# Altium project 驱动.PrjPcb
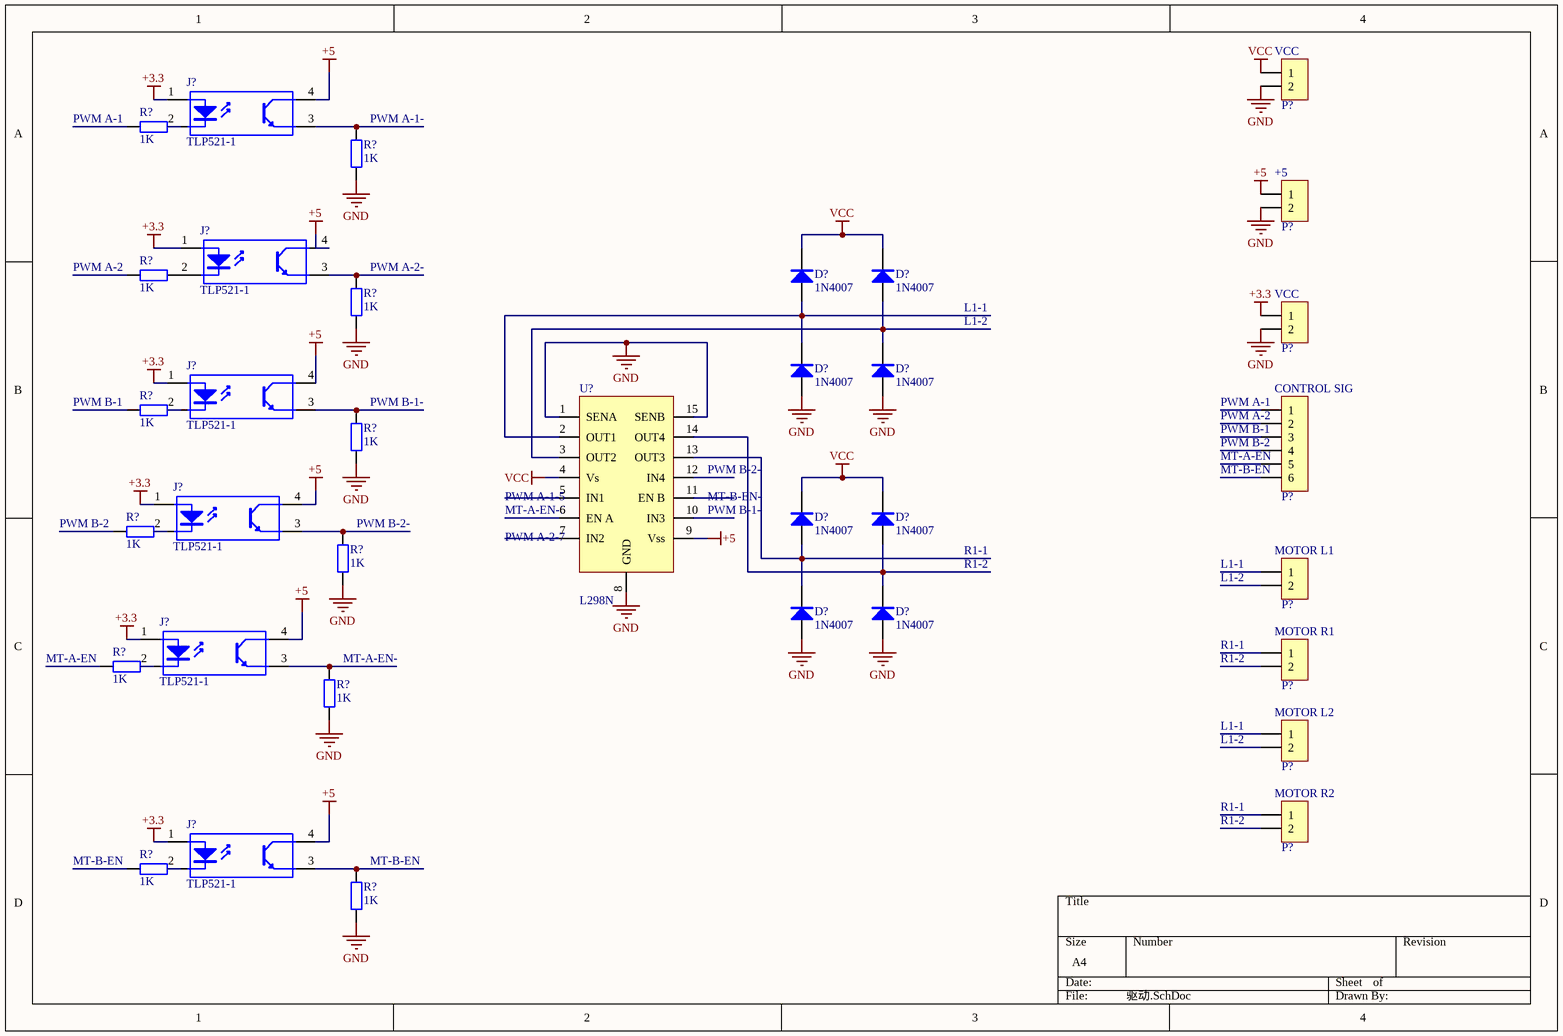
[diagram p0: 驱动.SchDoc]
1 sheet, 35 parts. Net scope: global (net labels, ports and power ports of the same name join across sheets).

## Sheet 驱动.SchDoc
size A4

### Parts
(Parts that share a designator on the sheet are numbered #1, #2 ... from top to bottom, then left to right.)
D?#1  1N4007  [C 1206_M]
D?#2  1N4007  [C 1206_M]
D?#3  1N4007  [C 1206_M]
D?#4  1N4007  [C 1206_M]
D?#5  1N4007  [C 1206_M]
D?#6  1N4007  [C 1206_M]
D?#7  1N4007  [C 1206_M]
D?#8  1N4007  [C 1206_M]
J?#1  TLP521-1  [DIP4-300]
J?#2  TLP521-1  [DIP4-300]
J?#3  TLP521-1  [DIP4-300]
J?#4  TLP521-1  [DIP4-300]
J?#5  TLP521-1  [DIP4-300]
J?#6  TLP521-1  [DIP4-300]
P?#1  HDR-1X2  [MX 1.25-WI-2P]  (value not drawn)
P?#2  HDR-1X2  [MX 1.25-WI-2P]  (value not drawn)
P?#3  HDR-1X2  [MX 1.25-WI-2P]  (value not drawn)
P?#4  CONTROL SIG  [MX 1.25-WI-6P]
P?#5  MOTOR L1  [MX 1.25-WI-2P]
P?#6  MOTOR R1  [MX 1.25-WI-2P]
P?#7  MOTOR L2  [MX 1.25-WI-2P]
P?#8  MOTOR R2  [MX 1.25-WI-2P]
R?#1  1K  [R 0805_L]
R?#2  1K  [R 0805_L]
R?#3  1K  [R 0805_L]
R?#4  1K  [R 0805_L]
R?#5  1K  [R 0805_L]
R?#6  1K  [R 0805_L]
R?#7  1K  [R 0805_L]
R?#8  1K  [R 0805_L]
R?#9  1K  [R 0805_L]
R?#10  1K  [R 0805_L]
R?#11  1K  [R 0805_L]
R?#12  1K  [R 0805_L]
U?  L298N  [Multiwatt15-V]

### Nets
+3.3: J?#1.1(A) J?#2.1(A) J?#3.1(A) J?#4.1(A) J?#5.1(A) J?#6.1(A) P?#3.1
+5: J?#1.4(C) J?#2.4(C) J?#3.4(C) J?#4.4(C) J?#5.4(C) J?#6.4(C) P?#2.1 U?.9(Vss)
GND: D?#3.1(A) D?#4.1(A) D?#7.1(A) D?#8.1(A) P?#1.2 P?#2.2 P?#3.2 R?#2.1 R?#4.1 R?#6.1 R?#8.1 R?#10.1 R?#12.1 U?.1(SENA) U?.8(GND) U?.15(SENB)
VCC: D?#1.2(K) D?#2.2(K) D?#5.2(K) D?#6.2(K) P?#1.1 U?.4(Vs)
NetD?#1_1: D?#1.1(A) D?#3.2(K) U?.2(OUT1)
NetD?#2_1: D?#2.1(A) D?#4.2(K) U?.3(OUT2)
NetD?#5_1: D?#5.1(A) D?#7.2(K) U?.13(OUT3)
NetD?#6_1: D?#6.1(A) D?#8.2(K) U?.14(OUT4)
NetJ?#1_2: J?#1.2(K) R?#1.2
NetJ?#1_3: J?#1.3(E) R?#2.2
NetJ?#2_2: J?#2.2(K) R?#3.2
NetJ?#2_3: J?#2.3(E) R?#4.2
NetJ?#3_2: J?#3.2(K) R?#5.2
NetJ?#3_3: J?#3.3(E) R?#6.2
NetJ?#4_2: J?#4.2(K) R?#7.2
NetJ?#4_3: J?#4.3(E) R?#8.2
NetJ?#5_2: J?#5.2(K) R?#9.2
NetJ?#5_3: J?#5.3(E) R?#10.2
NetJ?#6_2: J?#6.2(K) R?#11.2
NetJ?#6_3: J?#6.3(E) R?#12.2

Not connected (* = marked no-connect by the designer): P?#4 1 2 3 4 5 6; P?#5 1 2; P?#6 1 2; P?#7 1 2; P?#8 1 2; R?#1 1; R?#3 1; R?#5 1; R?#7 1; R?#9 1; R?#11 1; U? 5(IN1) 6(EN_A) 7(IN2) 10(IN3) 11(EN_B) 12(IN4)

### Notes on the sheet
- (near P?#1) VCC
- (near R?#1) PWM A-1
- (near R?#2) PWM A-1-
- (near P?#2) +5
- (near R?#3) PWM A-2
- (near R?#4) PWM A-2-
- L1-1
- (near P?#3) VCC
- L1-2
- (near R?#5) PWM B-1
- (near R?#6) PWM B-1-
- (near P?#4) PWM A-1
- (near P?#4) PWM A-2
- (near P?#4) PWM B-1
- (near P?#4) PWM B-2
- (near U?) PWM A-1-5
- (near U?) MT-A-EN-6
- (near U?) PWM B-2-
- MT-B-EN-
- PWM B-1-
- (near P?#4) MT-A-EN
- (near P?#4) MT-B-EN
- (near R?#7) PWM B-2
- (near R?#8) PWM B-2-
- (near U?) PWM A-2-7
- R1-1
- R1-2
- (near P?#5) L1-1
- (near P?#5) L1-2
- (near P?#6) R1-1
- (near R?#9) MT-A-EN
- (near R?#10) MT-A-EN-
- (near P?#6) R1-2
- (near P?#7) L1-1
- (near P?#7) L1-2
- (near P?#8) R1-1
- (near P?#8) R1-2
- (near R?#11) MT-B-EN
- (near R?#12) MT-B-EN

### Library data of the parts
D?#1-D?#8 = 1N4007: 整流二极管; 淘宝ID: 封装库来自淘宝 ID：黄晶宝石; 封装库来自淘宝卖家 ID：黄晶宝石: 其他店铺购入均为盗版，不享受售后技术支持服务，请立即申请退款; BOM名称: 整流二极管; 联系售后，技术支持: https://shop463601444.taobao.com
J?#1-J?#6 = TLP521-1: 1路开关光耦; 版权归属: 封装库来自淘宝 ID：黄晶宝石; BOM名称: 1路开关光耦; 学习资源: https://shop463601444.taobao.com
P?#1-P?#3 P?#5-P?#8 = Header 2: 2P接插件; 版权归属: 封装库来自淘宝 ID：黄晶宝石; 技术支持，联系售后: 封装库来自淘宝卖家 ID：黄晶宝石; BOM名称: 2P接插件; 联系售后: https://shop463601444.taobao.com
P?#4 = Header 6: 6P接插件; 版权归属: 封装库来自淘宝 ID：黄晶宝石; BOM名称: 6P接插件; 学习资源: https://shop463601444.taobao.com
R?#1-R?#12 = R: 贴片电阻; 版权归属: 来自淘宝 ID：黄晶宝石; 封装库来自淘宝卖家 ID：黄晶宝石: 其他店铺购入均为盗版，不享受售后技术支持服务，请立即申请退款; BOM名称: 贴片电阻; 联系售后: https://shop463601444.taobao.com